# Altium schematic sheet Плата 349.SchDoc
size 209 x 297 mm; SheetNumber: 5; SheetTotal: 5
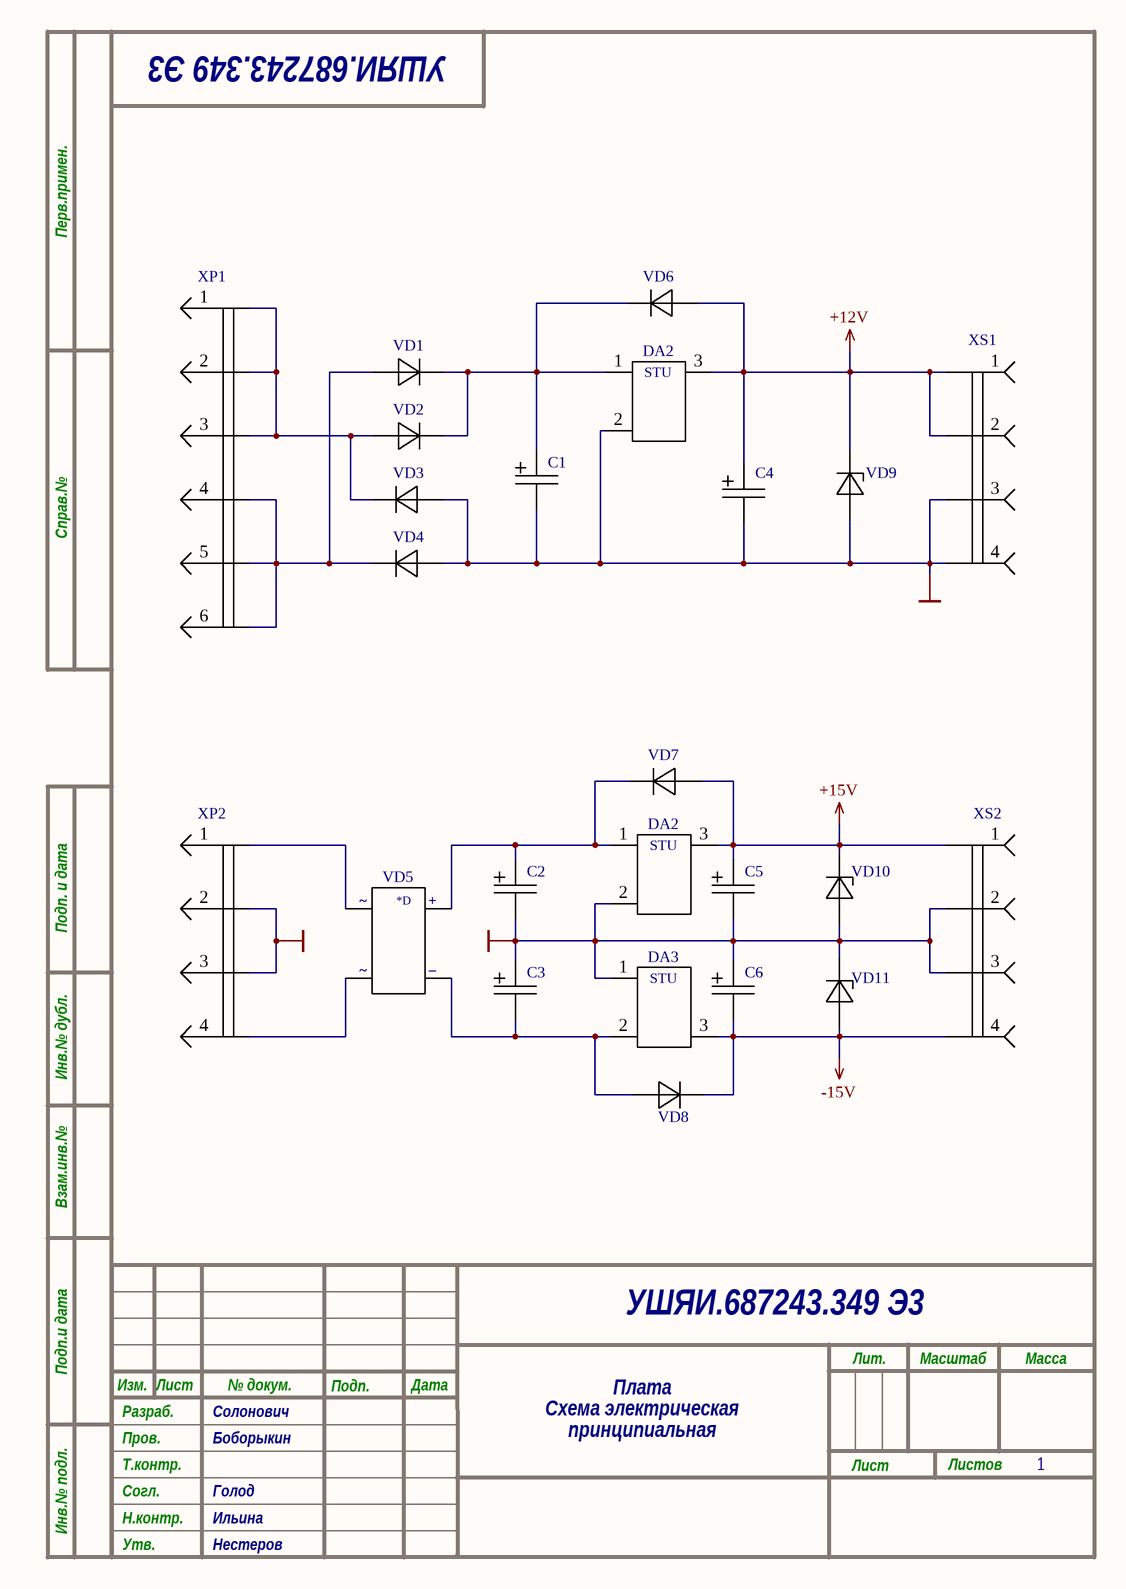
[diagram p0: Плата 349.SchDoc]

## Parts
(Parts that share a designator on the sheet are numbered #1, #2 ... from top to bottom, then left to right.)
C1  Полярный конденсатор  (value not drawn)
C2  Полярный конденсатор  (value not drawn)
C3  Полярный конденсатор  (value not drawn)
C4  Полярный конденсатор  (value not drawn)
C5  Полярный конденсатор  (value not drawn)
C6  Полярный конденсатор  (value not drawn)
DA2#1  Микросхема 2  (value not drawn)
DA2#2  Микросхема 2  (value not drawn)
DA3  Микросхема 3  (value not drawn)
VD1  Диод  (value not drawn)
VD2  Диод  (value not drawn)
VD3  Диод  (value not drawn)
VD4  Диод  (value not drawn)
VD5  Диодный мост  (value not drawn)
VD6  Диод  (value not drawn)
VD7  Диод  (value not drawn)
VD8  Диод  (value not drawn)
VD9  Стабилитрон  (value not drawn)
VD10  Стабилитрон  (value not drawn)
VD11  Стабилитрон  (value not drawn)
XP1  Вилка 6 пин  (value not drawn)
XP2  Вилка 4 пин  (value not drawn)
XS1  Розетка 4 пин  (value not drawn)
XS2  Розетка 4 пин  (value not drawn)

## Nets
+12V: C4.1 DA2#1.3 VD6.2 VD9.1 XS1.1 XS1.2
+15V: C5.1 DA2#2.3 VD7.2 VD10.1 XS2.1
-15V: C6.2 DA3.3 VD8.1 VD11.2 XS2.4
GND: C1.2 C2.2 C3.1 C4.2 C5.2 C6.1 DA2#1.2 DA2#2.2 DA3.1 VD3.2 VD4.2 VD9.2 VD10.2 VD11.1 XP2.2 XP2.3 XS1.3 XS1.4 XS2.2 XS2.3
NetC1_1: C1.1 DA2#1.1 VD1.1 VD2.1 VD6.1
NetC2_1: C2.1 DA2#2.1 VD5.3 VD7.1
NetC3_2: C3.2 DA3.2 VD5.2 VD8.2
NetVD1_2: VD1.2 VD4.1 XP1.4 XP1.5 XP1.6
NetVD2_2: VD2.2 VD3.1 XP1.1 XP1.2 XP1.3
NetVD5_1: VD5.1 XP2.1
NetVD5_3: VD5.3 XP2.4

## Notes on the sheet
- УШЯИ.687243.349 Э3
- Солонович
- Плата
- Схема электрическая
- Боборыкин
- принципиальная
- 1
- Голод
- Нестеров
- Ильина
- Перв.примен.
- Справ.№
- Подп. и дата
- Инв.№ дубл.
- Взам.инв.№
- Подп.и дата
- Разраб.
- Изм.
- Лист
- № докум.
- Подп.
- Дата
- Лит.
- Масштаб
- Масса
- Т.контр.
- Пров.
- Листов
- Инв.№ подл.
- Утв.
- Н.контр.
- Согл.
- (in symbol Диодный мост) ~; +; *D; _
- (in symbol Микросхема 2) STU
- (in symbol Микросхема 3) STU